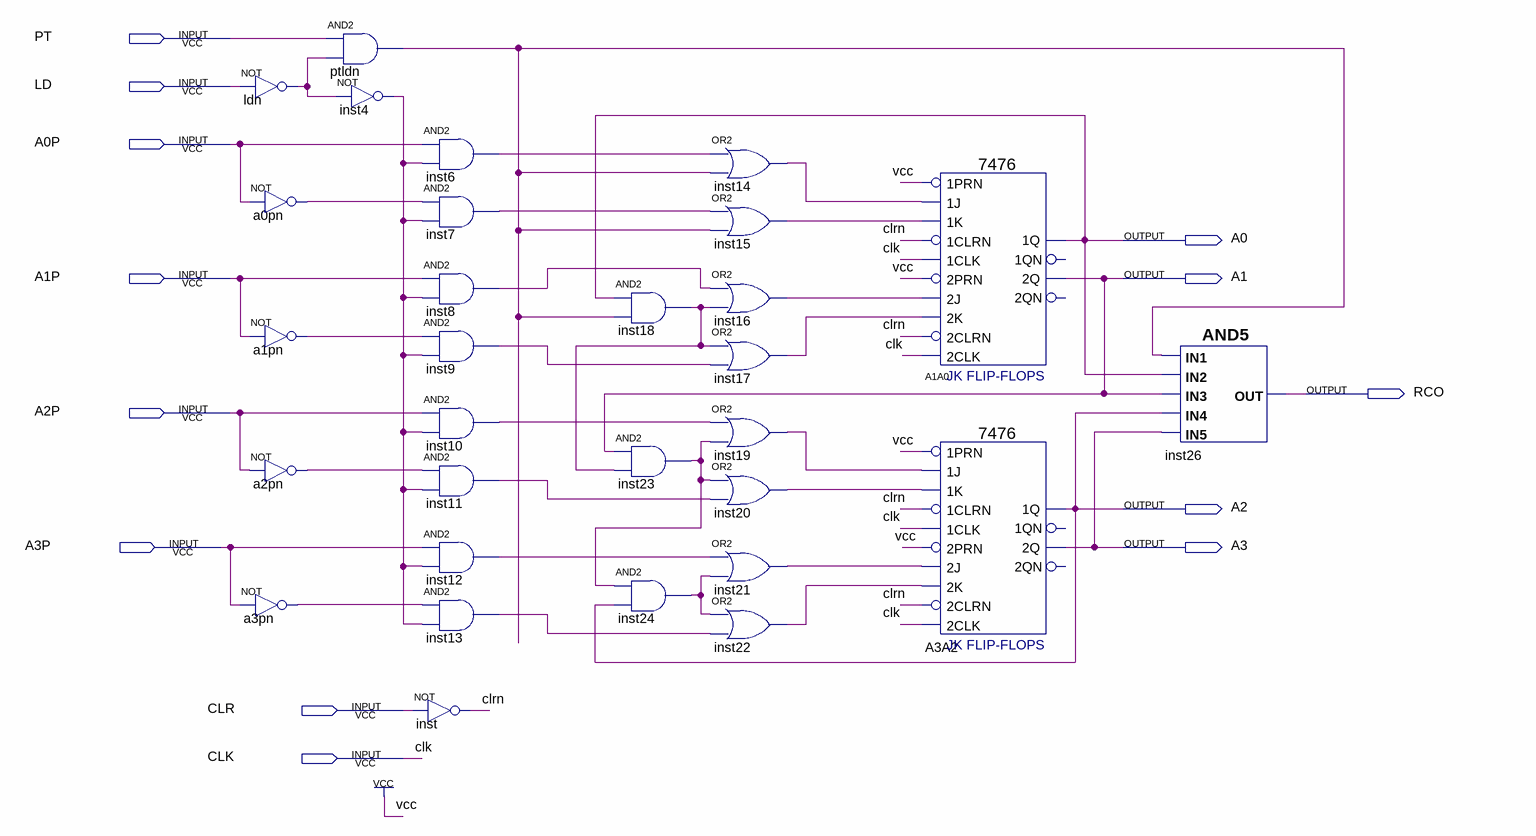
[diagram p0: schematic sheet]
// Quartus schematic Question3.bdf as structural Verilog: 30 symbols, 13 pins
module Question3 (
  input  PT,
  input  LD,
  input  A0P,
  input  A1P,
  input  A2P,
  input  A3P,
  input  CLR,
  input  CLK,
  output A0,
  output A1,
  output RCO,
  output A2,
  output A3
);

  wire a0pn_out, a1pn_out, a2pn_out, a3pn_out, clrn, inst4_out, inst6_out, inst7_out, inst8_out, inst9_out,
       inst10_out, inst11_out, inst12_out, inst13_out, inst14_out, inst15_out, inst16_out, inst17_out,
       inst18_out, inst19_out, inst20_out, inst21_out, inst22_out, inst23_out, inst24_out, ldn_out, ptldn_out;

  not ldn (ldn_out, LD);
  not a0pn (a0pn_out, A0P);
  not a1pn (a1pn_out, A1P);
  not a2pn (a2pn_out, A2P);
  not a3pn (a3pn_out, A3P);
  and ptldn (ptldn_out, PT, ldn_out);
  not inst4 (inst4_out, ldn_out);
  and inst6 (inst6_out, A0P, inst4_out);
  and inst7 (inst7_out, a0pn_out, inst4_out);
  and inst8 (inst8_out, A1P, inst4_out);
  and inst9 (inst9_out, a1pn_out, inst4_out);
  and inst10 (inst10_out, A2P, inst4_out);
  and inst11 (inst11_out, a2pn_out, inst4_out);
  and inst12 (inst12_out, A3P, inst4_out);
  and inst13 (inst13_out, a3pn_out, inst4_out);
  not inst (clrn, CLR);
  and inst18 (inst18_out, A0, ptldn_out);
  and inst23 (inst23_out, A1, inst18_out);
  and inst24 (inst24_out, inst23_out, A2);
  or inst14 (inst14_out, inst6_out, ptldn_out);
  or inst15 (inst15_out, inst7_out, ptldn_out);
  or inst16 (inst16_out, inst8_out, inst18_out);
  or inst17 (inst17_out, inst18_out, inst9_out);
  or inst19 (inst19_out, inst10_out, inst23_out);
  or inst20 (inst20_out, inst23_out, inst11_out);
  or inst21 (inst21_out, inst12_out, inst24_out);
  or inst22 (inst22_out, inst24_out, inst13_out);
  \7476  A1A0 (
    .\1J (inst14_out), .\1K (inst15_out), .\1PRN (1'b1), .\2PRN (1'b1), .\2J (inst16_out), .\1CLK (CLK),
    .\1CLRN (clrn), .\2K (inst17_out), .\2CLRN (clrn), .\2CLK (CLK), .\1Q (A0), .\2Q (A1));  // open: 2QN, 1QN
  \7476  A3A2 (
    .\1J (inst19_out), .\1K (inst20_out), .\1PRN (1'b1), .\2PRN (1'b1), .\2J (inst21_out), .\1CLK (CLK),
    .\1CLRN (clrn), .\2K (inst22_out), .\2CLRN (clrn), .\2CLK (CLK), .\1Q (A2), .\2Q (A3));  // open: 2QN, 1QN
  and inst26 (RCO, ptldn_out, A0, A1, A2, A3);
endmodule
